# EasyEDA Pro project DAC8563.eprj

# Schematic Schematic1
Create Date: 2023-06-18; Page Name: P1; Project Name: DAC8563; Schematic Name: Schematic1; Update Date: 2023-07-07; Company: 嘉立创EDA; Page Size: A4; Version: V1.0
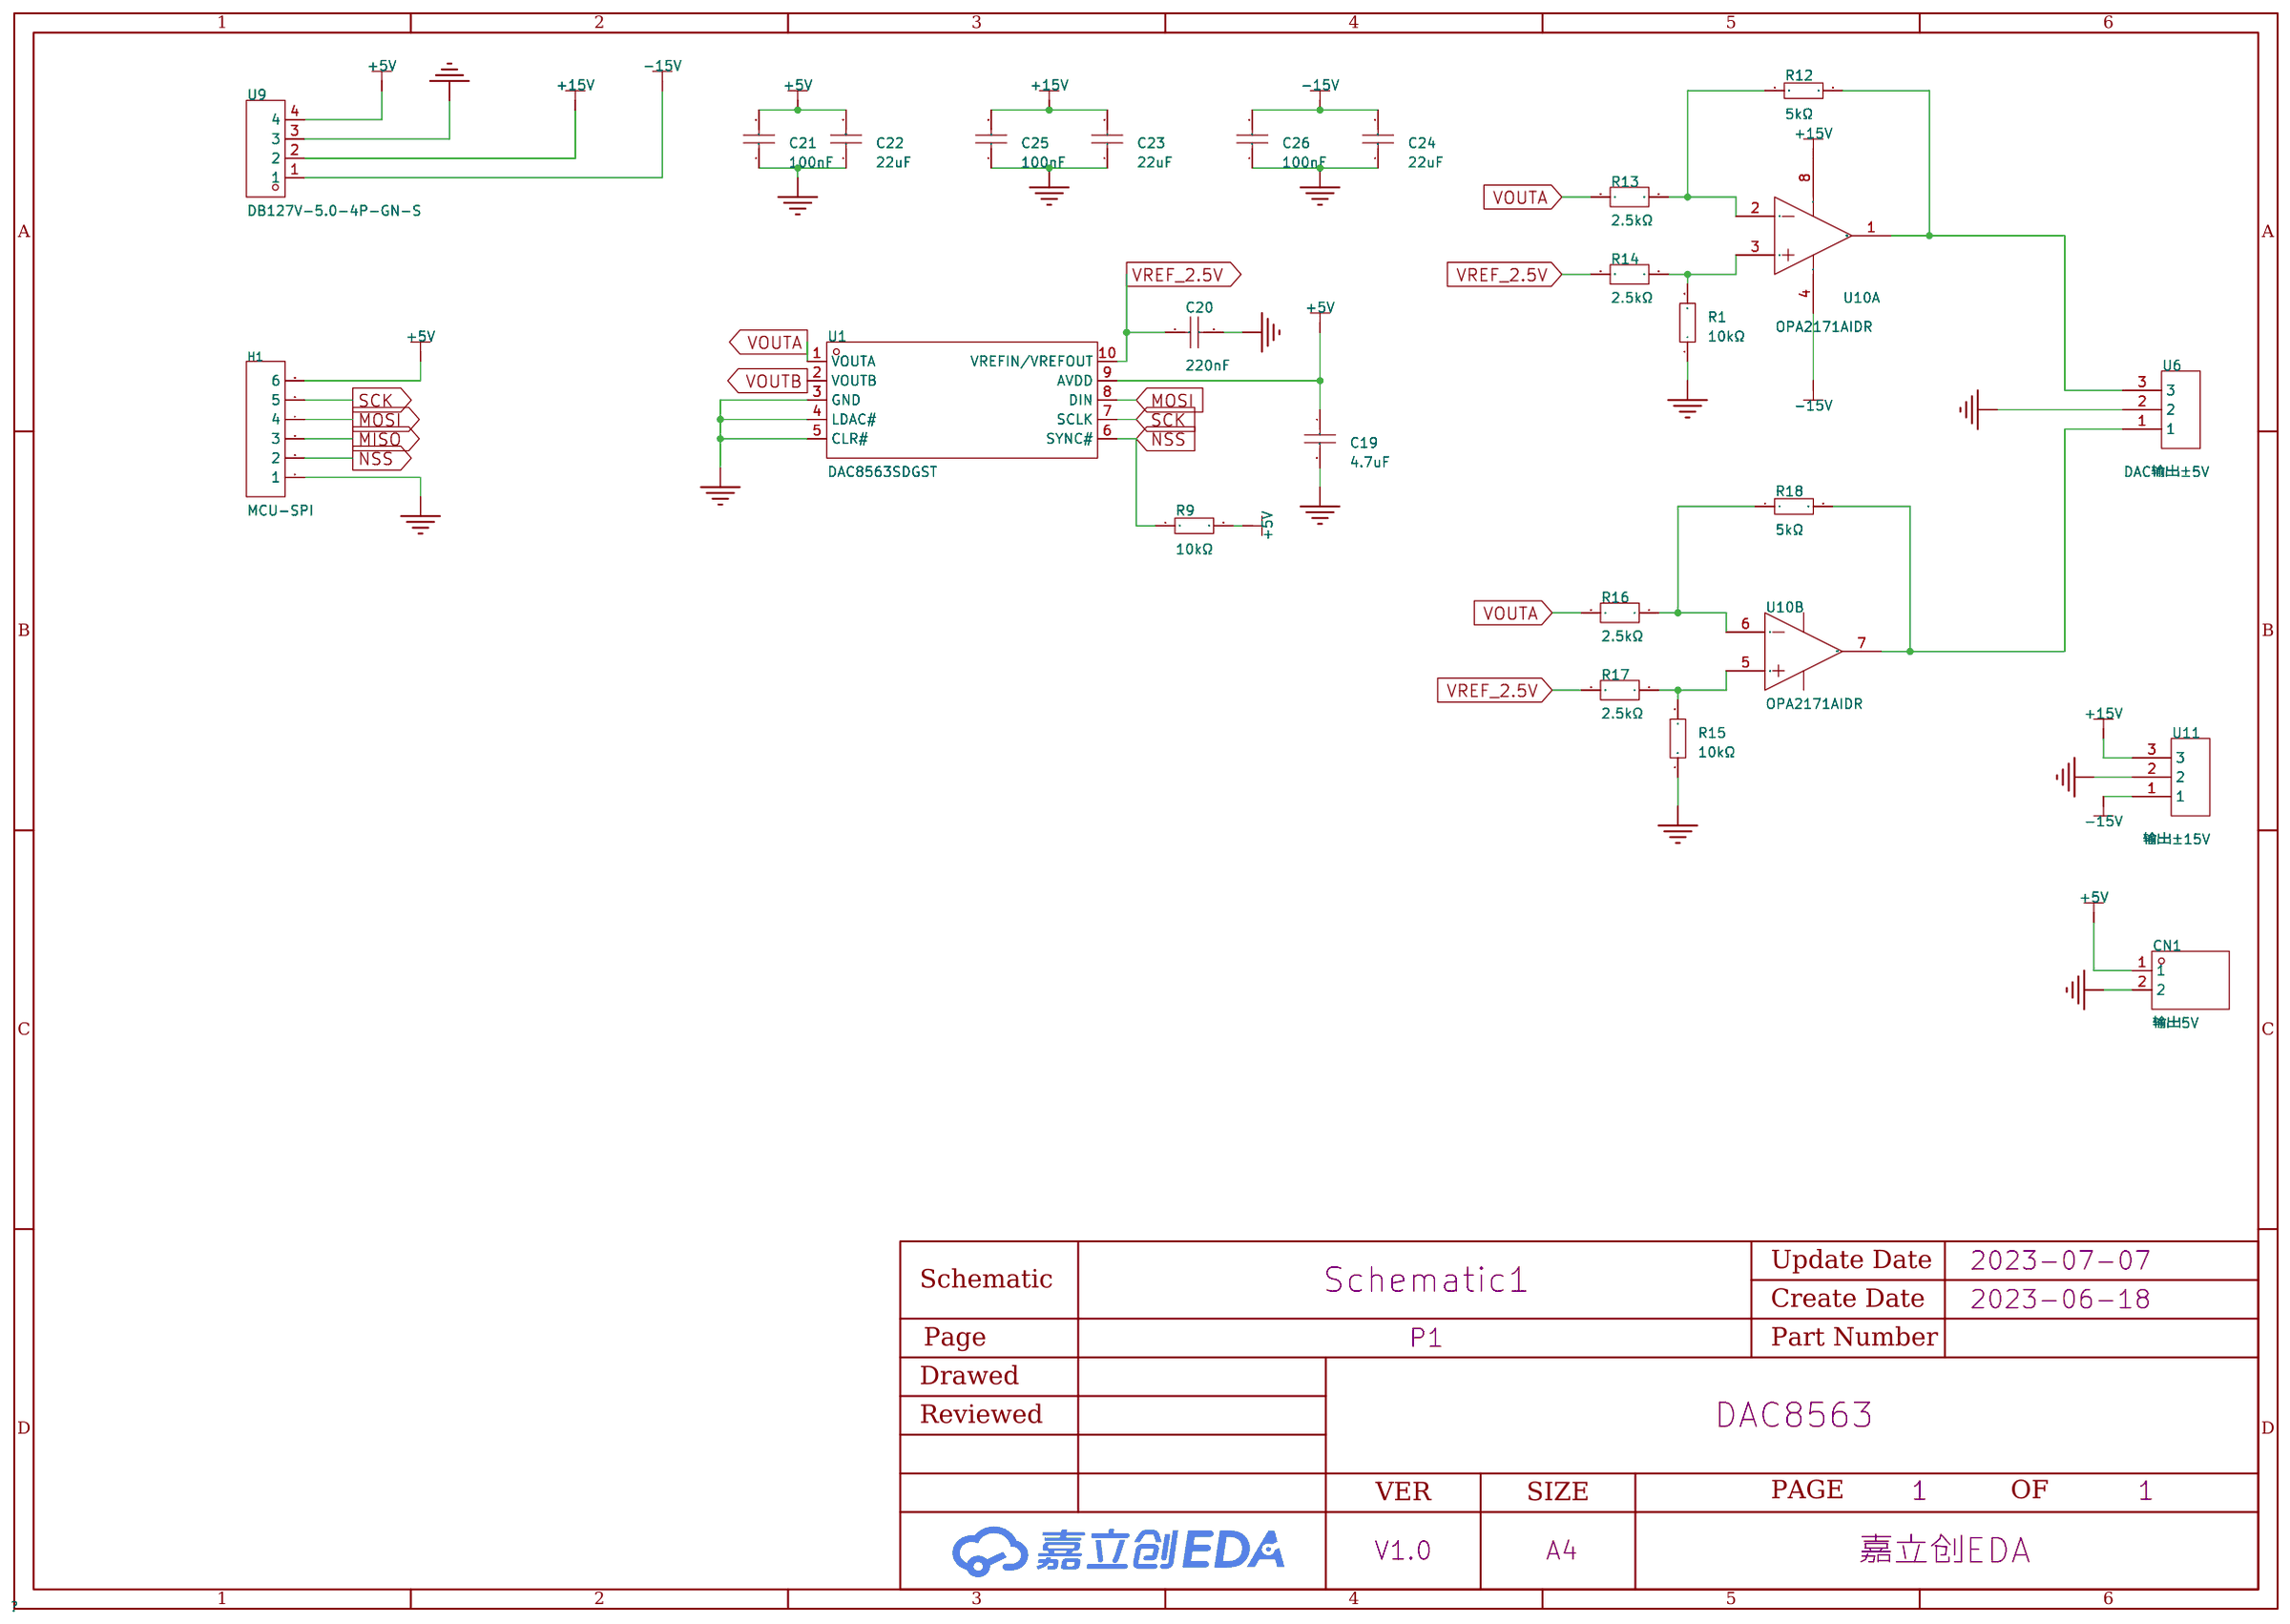
[diagram p0: schematic sheet]

## Parts
C19  4.7uF  [C0805]
C20  220nF  [C0805]
C21  100nF  [C0805]
C22  22uF  [C0805]
C23  22uF  [C0805]
C24  22uF  [C0805]
C25  100nF  [C0805]
C26  100nF  [C0805]
CN1  输出5V  [CONN-TH_B2B-XH-A-LF-SN]
H1  MCU-SPI  [HDR-TH_6P-P2.54-V-M-1]
R1  10kΩ  [R0805]
R9  10kΩ  [R0805]
R12  5kΩ  [R0805]
R13  2.5kΩ  [R0805]
R14  2.5kΩ  [R0805]
R15  10kΩ  [R0805]
R16  2.5kΩ  [R0805]
R17  2.5kΩ  [R0805]
R18  5kΩ  [R0805]
U1  DAC8563SDGST  [VSSOP-10_L3.0-W3.0-P0.50-LS4.9-BL]
U6  DAC输出±5V  [CONN-TH_3P-P2.50_A2501WV2-3P]
U9  DB127V-5.0-4P-GN-S  [CONN-TH_4P-P5.00_DB127V-5.0-4P-GN-S]
U10  OPA2171AIDR  [SOIC-8_L5.0-W4.0-P1.27-LS6.0-BL]  (sections 1,2)
U11  输出±15V  [CONN-TH_3P-P2.50_A2501WV2-3P]

## Library data of the parts
C19-C26 = 0805B104K500NT: 容值:100nF;精度:±10%;额定电压:50V;材质(温度系数):X7R;; LCSC Part Name: 100nF ±10% 50V; Supplier Part: C38141; Manufacturer: FH(风华); Supplier Footprint: 0805; JLCPCB Part Class: Extended Part; Datasheet: https://atta.szlcsc.com/upload/public/pdf/source/20170923/C38141_1506149447419988747.pdf; Supplier: LCSC; Tolerance: ±10%; Voltage Rated: 50V; Temperature Coefficient: X7R
CN1 = B2B-XH-A(LF)(SN): 参考系列:XH;间距:2.5mm;插针结构:1x2P;排数:1;每排PIN数:2;行距:-;安装方式:-;触头材质:黄铜;; LCSC Part Name: XH 2.5mm 1x2P; Supplier Part: C158012; Manufacturer: JST; Supplier Footprint: 插件,P=2.5mm; JLCPCB Part Class: Extended Part; Datasheet: https://atta.szlcsc.com/upload/public/pdf/source/20180319/9D0AC2122F92891443E3C996983D6D0E.pdf; Supplier: LCSC; Reference Series: XH; Pitch: 2.5mm; Pins Structure: 1x2P; Number of Rows: 1; Number of PINs Per Row: 2; Contact Material: 黄铜
H1 = 2.54-1x6P直针: 排数:单排;总PIN位数:6;间距:2.54mm;插针结构:1x6P;行距:-;安装类型:直插;圆针/方针:方针;额定电流:3A;额定电压:-;配合针长度:-;塑高:-;触头材质:黄铜;触头镀层:-;工作温度范围:-40℃~+105℃;颜色:黑色;; LCSC Part Name: 2.54mm 1x6P 直插 方针; Supplier Part: C37208; Manufacturer: BOOMELE(博穆精密); Supplier Footprint: 直插,P=2.54mm; JLCPCB Part Class: Extended Part; Supplier: LCSC; Number of Rows: 单排; Number of Pins: 6; Pitch: 2.54mm; Pin Structure: 1x6P; Mounting Type: 直插; Circluar Pins/Square Pins: 方针; Current Rating (Max): 3A; Contact Material: 黄铜; Operating Temperature Range: -40℃~+105℃; Color: 黑色
R1 R9 R12 R15 R18 = 0805W8F1002T5E_C17414: 电阻类型:厚膜电阻;阻值:10kΩ;精度:±1%;功率:125mW;; LCSC Part Name: 10kΩ ±1% 125mW; Supplier Part: C17414; Manufacturer: UNI-ROYAL(厚声); Manufacturer Part: 0805W8F1002T5E; Supplier Footprint: 0805; JLCPCB Part Class: Basic Part; Datasheet: https://atta.szlcsc.com/upload/public/pdf/source/20200306/C422600_1E6D84923E4A46A82E41ADD87F860B5C.pdf; Supplier: LCSC; Type: 厚膜电阻; Tolerance: ±1%; Power(Watts): 125mW; Temperature Coefficient: ±100ppm/℃; Overload Voltage (Max): 150V; Operating Temperature Range: -55℃~+155℃
R13 R14 R16 R17 = ARG05BTC2501N: 电阻类型:薄膜电阻;阻值:2.5kΩ;精度:±0.1%;功率:125mW;; LCSC Part Name: 2.5kΩ ±0.1% 125mW; Supplier Part: C2828736; Manufacturer: Viking(光颉); Supplier Footprint: 0805; JLCPCB Part Class: Extended Part; Datasheet: https://atta.szlcsc.com/upload/public/pdf/source/20211009/C2828736_56AC36CEB140B466557860EA8A132A37.pdf; Supplier: LCSC; Type: 薄膜电阻; Tolerance: ±0.1%; Power(Watts): 125mW; Temperature Coefficient: ±25ppm/℃; Overload Voltage (Max): 150V; Operating Temperature Range: -55℃~+155℃
U1 = DAC8563SDGST: Supplier Part: C2679492; Manufacturer: TI(德州仪器); Supplier Footprint: VSSOP-10-0.5mm; JLCPCB Part Class: Extended Part; Datasheet: https://atta.szlcsc.com/upload/public/pdf/source/20230221/ACD21AD43AD3151303AC8D1AE3FDF78F.pdf; Supplier: LCSC
U6 U11 = B3B-XH-A(LF)(SN): 参考系列:XH;间距:2.5mm;插针结构:1x3P;排数:1;每排PIN数:3;行距:-;安装方式:-;触头材质:黄铜;; LCSC Part Name: XH 2.5mm 1x3P; Supplier Part: C144394; Manufacturer: JST; Supplier Footprint: 插件,P=2.5mm; JLCPCB Part Class: Extended Part; Datasheet: https://atta.szlcsc.com/upload/public/pdf/source/20180327/C144394_40EBA2F68C817AED706C9EFF4B81600D.pdf; Supplier: LCSC; Reference Series: XH; Pitch: 2.5mm; Pins Structure: 1x3P; Number of Rows: 1; Number of PINs Per Row: 3; Contact Material: 黄铜
U9 = DB127V-5.0-4P-GN-S: 间距:5mm;排数:1;每排PIN数:4;安装方式:直针;额定电流:15A;额定电压:250V;线规 - AWG:14~26;线规 - mm?:1.5;工作温度范围:-40℃~+105℃;颜色:绿色;; LCSC Part Name: 5mm 排数:1 每排P数:4 直针; Supplier Part: C430624; Manufacturer: DIBO(地博电气); Supplier Footprint: 直插,P=5mm; JLCPCB Part Class: Extended Part; Datasheet: https://atta.szlcsc.com/upload/public/pdf/source/20211103/E26D74FF571F86D3B05732CA36761FFA.pdf; Supplier: LCSC; Pitch: 5mm; Number of Rows: 1; Number of PINs Per Row: 4; Mounting Style: 直针; Current Rating (Max): 15A; Voltage Rating (Max): 250V; Wire Gauge - AWG: 14~26; Wire Gauge - mm?: 1.5; Operating Temperature Range: -40℃~+105℃; Color: 绿色
U10 = OPA2171AIDR: 运放类型:General Purpose;放大器组数:2;增益带宽积（GBP）:3MHz;压摆率（SR）:1.5 V/us;电源电压:2.7V ~ 36V, ±1.35V ~ 18V;各通道供电电流:475uA;; Supplier Part: C40904; Manufacturer: TI(德州仪器); Supplier Footprint: SOIC-8; JLCPCB Part Class: Extended Part; Datasheet: https://atta.szlcsc.com/upload/public/pdf/source/20150124/1457707260506.pdf; Supplier: LCSC; Amplifier Type: General Purpose; Number of Circuits: 2; Gain Bandwidth Product（GBP）: 3MHz; Slew Rate（SR）: 1.5 V/us; Output Type: Rail-to-Rail; Supply Voltage（Single）: 2.7V ~ 36V, ±1.35V ~ 18V; Iq per channel (Typ): 475uA; Operating Temperature: -40°C ~ 125°C

## Nets
+5V: C19.1 C21.2 C22.2 CN1.1 H1.6 R9.2 U1.9(AVDD) U9.4
+15V: C23.2 C25.2 U9.2 U10.8(V+) U11.3
-15V: C24.2 C26.2 U9.1 U10.4(V-) U11.1
GND: C19.2 C20.2 C21.1 C22.1 C23.1 C24.1 C25.1 C26.1 CN1.2 H1.1 R1.1 R15.1 U1.3(GND) U1.4(LDAC#) U1.5(CLR#) U6.2 U9.3 U11.2
MISO: H1.3
MOSI: H1.4 U1.8(DIN)
NSS: H1.2 R9.1 U1.6(SYNC#)
SCK: H1.5 U1.7(SCLK)
VOUTA: R13.2 R16.2 U1.1(VOUTA)
VOUTB: U1.2(VOUTB)
VREF_2.5V: C20.1 R14.2 R17.2 U1.10(VREFIN/VREFOUT)
$1N6932: R1.2 R14.1 U10.3(IN A+)
$1N7066: R12.2 U6.3 U10.1(OUT A)
$1N8071: R12.1 R13.1 U10.2(IN A-)
$1N8400: R15.2 R17.1 U10.5(IN B+)
$1N8452: R16.1 R18.1 U10.6(IN B-)
$1N8456: R18.2 U6.1 U10.7(OUT B)

# Schematic Schematic2
Create Date: 2023-07-07; Page Name: P1; Project Name: DAC8563; Schematic Name: Schematic2; Update Date: 2023-07-07; Company: 嘉立创EDA; Page Size: A4; Version: V1.0
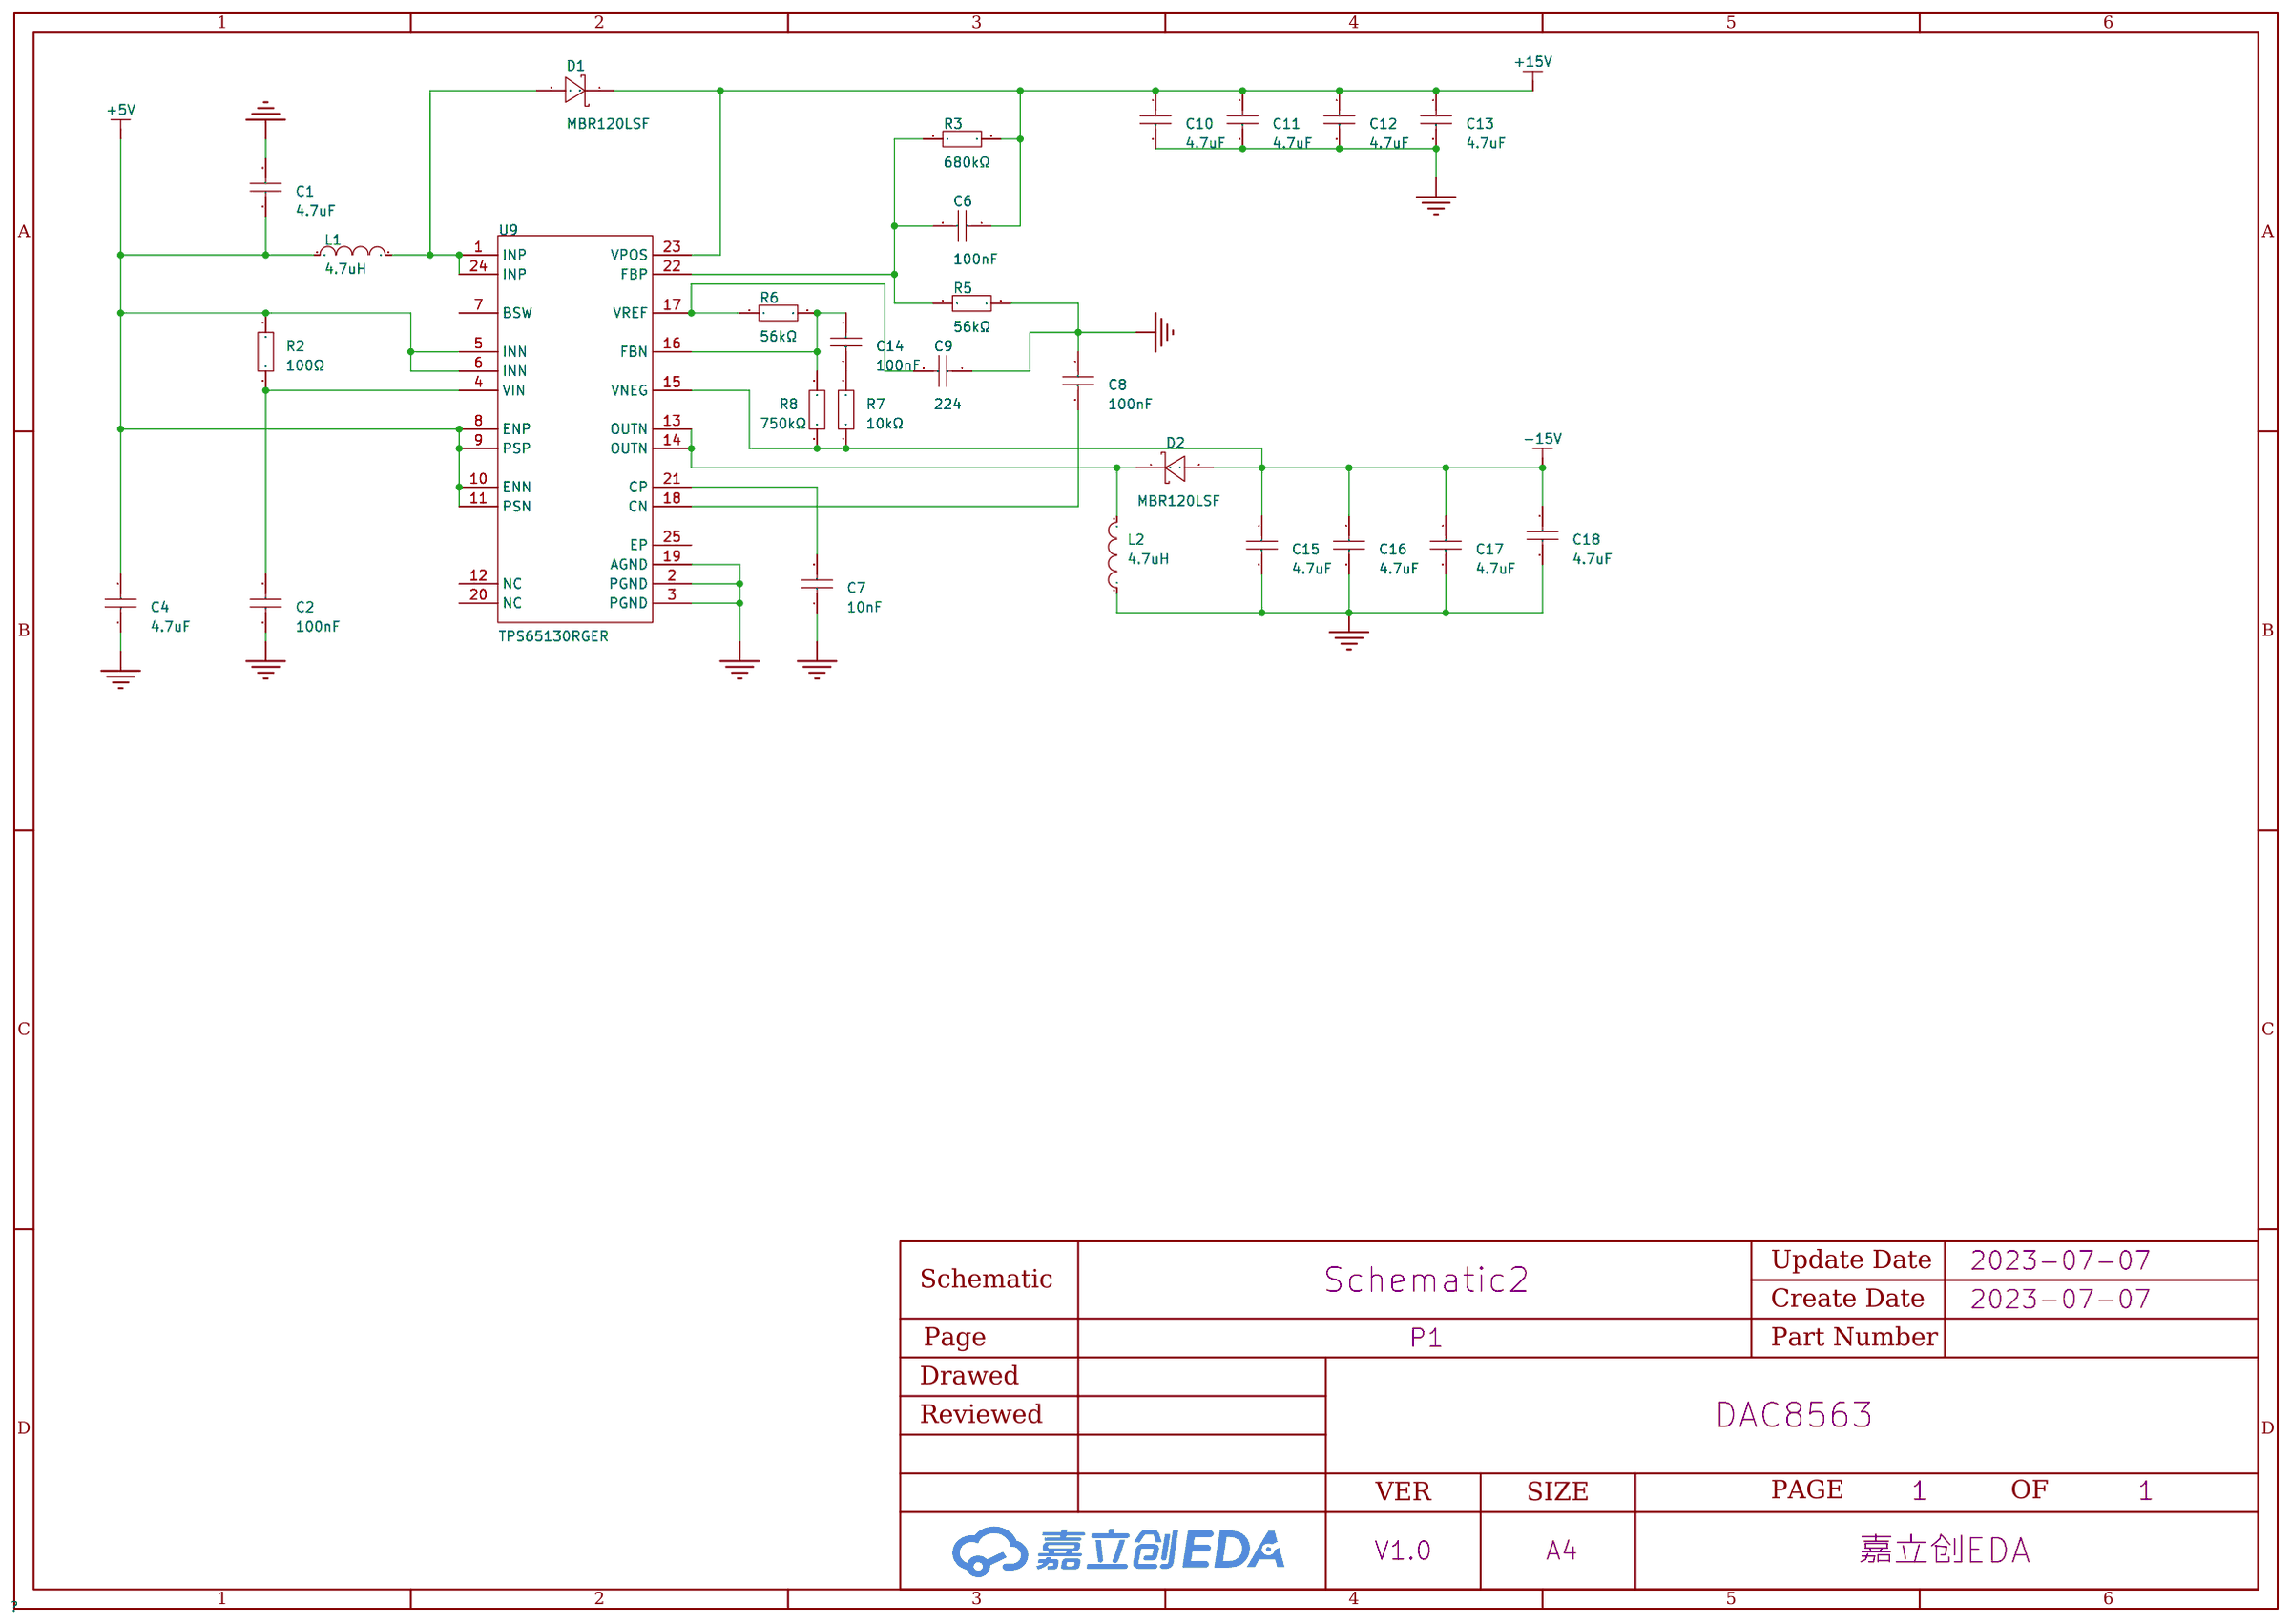
[diagram p1: schematic sheet]

## Parts
C1  4.7uF  [C0805]
C2  100nF  [C0805]
C4  4.7uF  [C0805]
C6  100nF  [C0805]
C7  10nF  [C0805]
C8  100nF  [C0805]
C9  224  [C0805]
C10  4.7uF  [C0805]
C11  4.7uF  [C0805]
C12  4.7uF  [C0805]
C13  4.7uF  [C0805]
C14  100nF  [C0805]
C15  4.7uF  [C0805]
C16  4.7uF  [C0805]
C17  4.7uF  [C0805]
C18  4.7uF  [C0805]
D1  MBR120LSF  [SOD-123_L2.8-W1.8-LS3.7-RD]
D2  MBR120LSF  [SOD-123_L2.8-W1.8-LS3.7-RD]
L1  4.7uH  [IND-SMD_L4.0-W4.0]
L2  4.7uH  [IND-SMD_L4.0-W4.0]
R2  100Ω  [R0805]
R3  680kΩ  [R0805]
R5  56kΩ  [R0805]
R6  56kΩ  [R0805]
R7  10kΩ  [R0805]
R8  750kΩ  [R0805]
U9  TPS65130RGER  [VQFN-24_L4.0-W4.0-P0.50-TL-EP]

## Library data of the parts
C1 C4 = CL21A475KAQNNNE: 容值:4.7uF;精度:±10%;额定电压:25V;材质(温度系数):X5R;; LCSC Part Name: 4.7uF ±10% 25V; Supplier Part: C1779; Manufacturer: SAMSUNG(三星); Supplier Footprint: 0805; JLCPCB Part Class: Basic Part; Datasheet: https://atta.szlcsc.com/upload/public/pdf/source/20160103/1457707696447.pdf; Supplier: LCSC; Tolerance: ±10%; Voltage Rated: 25V; Temperature Coefficient: X5R
C2 C6-C18 = 0805B104K500NT: 容值:100nF;精度:±10%;额定电压:50V;材质(温度系数):X7R;; LCSC Part Name: 100nF ±10% 50V; Supplier Part: C38141; Manufacturer: FH(风华); Supplier Footprint: 0805; JLCPCB Part Class: Extended Part; Datasheet: https://atta.szlcsc.com/upload/public/pdf/source/20170923/C38141_1506149447419988747.pdf; Supplier: LCSC; Tolerance: ±10%; Voltage Rated: 50V; Temperature Coefficient: X7R
D1 D2 = MBR120LSF: 直流反向耐压(Vr):20V;平均整流电流(Io):1A;正向压降(Vf):600mV@1A;; LCSC Part Name: 20V 1A 600mV@1A; Supplier Part: C130880; Manufacturer: SHIKUES(时科); Supplier Footprint: SOD-123; JLCPCB Part Class: Extended Part; Datasheet: https://atta.szlcsc.com/upload/public/pdf/source/20170918/C130880_1505703436167975387.pdf; Supplier: LCSC; Reverse Voltage (Vr): 20V; Average Rectified Current (Io): 1A; Forward Voltage (Vf@If): 600mV@1A
L1 L2 = SWPA4030S4R7MT: 直流电阻(DCR):78mΩ;精度:±20%;电感值:4.7uH;额定电流:2A;; LCSC Part Name: 4.7uH ±20%; Supplier Part: C57269; Manufacturer: Sunlord(顺络); Supplier Footprint: SMD; JLCPCB Part Class: Extended Part; Datasheet: https://atta.szlcsc.com/upload/public/pdf/source/20161024/1477287957557.pdf; Supplier: LCSC; DC Resistance (DCR): 78mΩ; Tolerance: ±20%; Height: 3mm; Width: 4mm; Rated Current: 2A; Length: 4mm
R2 = 0805W8F1000T5E: 电阻类型:厚膜电阻;阻值:100Ω;精度:±1%;功率:125mW;; LCSC Part Name: 100Ω ±1% 125mW; Supplier Part: C17408; Manufacturer: UNI-ROYAL(厚声); Supplier Footprint: 0805; JLCPCB Part Class: Basic Part; Datasheet: https://atta.szlcsc.com/upload/public/pdf/source/20200306/C422600_1E6D84923E4A46A82E41ADD87F860B5C.pdf; Supplier: LCSC; Type: 厚膜电阻; Tolerance: ±1%; Power(Watts): 125mW; Temperature Coefficient: ±100ppm/℃; Overload Voltage (Max): 150V; Operating Temperature Range: -55℃~+155℃
R3 R5-R8 = 0805W8F1002T5E_C17414: 电阻类型:厚膜电阻;阻值:10kΩ;精度:±1%;功率:125mW;; LCSC Part Name: 10kΩ ±1% 125mW; Supplier Part: C17414; Manufacturer: UNI-ROYAL(厚声); Manufacturer Part: 0805W8F1002T5E; Supplier Footprint: 0805; JLCPCB Part Class: Basic Part; Datasheet: https://atta.szlcsc.com/upload/public/pdf/source/20200306/C422600_1E6D84923E4A46A82E41ADD87F860B5C.pdf; Supplier: LCSC; Type: 厚膜电阻; Tolerance: ±1%; Power(Watts): 125mW; Temperature Coefficient: ±100ppm/℃; Overload Voltage (Max): 150V; Operating Temperature Range: -55℃~+155℃
U9 = TPS65130RGER: 功能类型:升压型；升降压型;同步整流:否;输出类型:可调;输出通道数:2;拓扑结构:升压式；降压式-升压式;输入电压:2.7V~5.5V;输出电压:±15V;输出电流(最大值):700mA;开关频率:1.38MHz;工作温度:-40℃~+85℃@(TA);; LCSC Part Name: 升降压型 升压型 Vin=2.7V~5.5V Vout=±15V 700mA; Supplier Part: C54989; Manufacturer: TI(德州仪器); Supplier Footprint: QFN-24(4x4); JLCPCB Part Class: Extended Part; Datasheet: https://atta.szlcsc.com/upload/public/pdf/source/20170925/C54989_1506321722096990529.pdf; Supplier: LCSC; Function: 升压型；升降压型; Synchronous Rectification: 否; Output Type: 可调; Number of Outputs: 2; Topology: 升压式；降压式-升压式; Input Voltage: 2.7V~5.5V; Output Voltage: ±15V; Output Current (Max): 700mA; Switching Frequency: 1.38MHz; Operating Temperature: -40℃~+85℃@(TA)

## Nets
+5V: C1.1 C4.2 L1.1 R2.2 U9.5(INN) U9.6(INN) U9.8(ENP) U9.9(PSP) U9.10(ENN) U9.11(PSN)
+15V: C6.1 C10.1 C11.1 C12.1 C13.1 D1.1(C) R3.2 U9.23(VPOS)
-15V: C15.1 C16.1 C17.1 C18.1 D2.2(A) R7.1 R8.2 U9.15(VNEG)
GND: C1.2 C2.1 C4.1 C7.1 C8.1 C9.1 C10.2 C11.2 C12.2 C13.2 C15.2 C16.2 C17.2 C18.2 L2.1 R5.2 U9.2(PGND) U9.3(PGND) U9.19(AGND)
Net-(C2-2): C2.2 R2.1 U9.4(VIN)
Net-(C6-2): C6.2 R3.1 R5.1 U9.22(FBP)
Net-(C7-2): C7.2 U9.21(CP)
Net-(C8-2): C8.2 U9.18(CN)
Net-(C9-2): C9.2 R6.1 U9.17(VREF)
Net-(C14-1): C14.1 R6.2 R8.1 U9.16(FBN)
Net-(C14-2): C14.2 R7.2
Net-(D1-2): D1.2(A) L1.2 U9.1(INP) U9.24(INP)
Net-(D2-1): D2.1(C) L2.2 U9.13(OUTN) U9.14(OUTN)

Not connected (* = marked no-connect by the designer): U9 7(BSW) 12(NC) 20(NC) 25(EP)

# Board PCB1
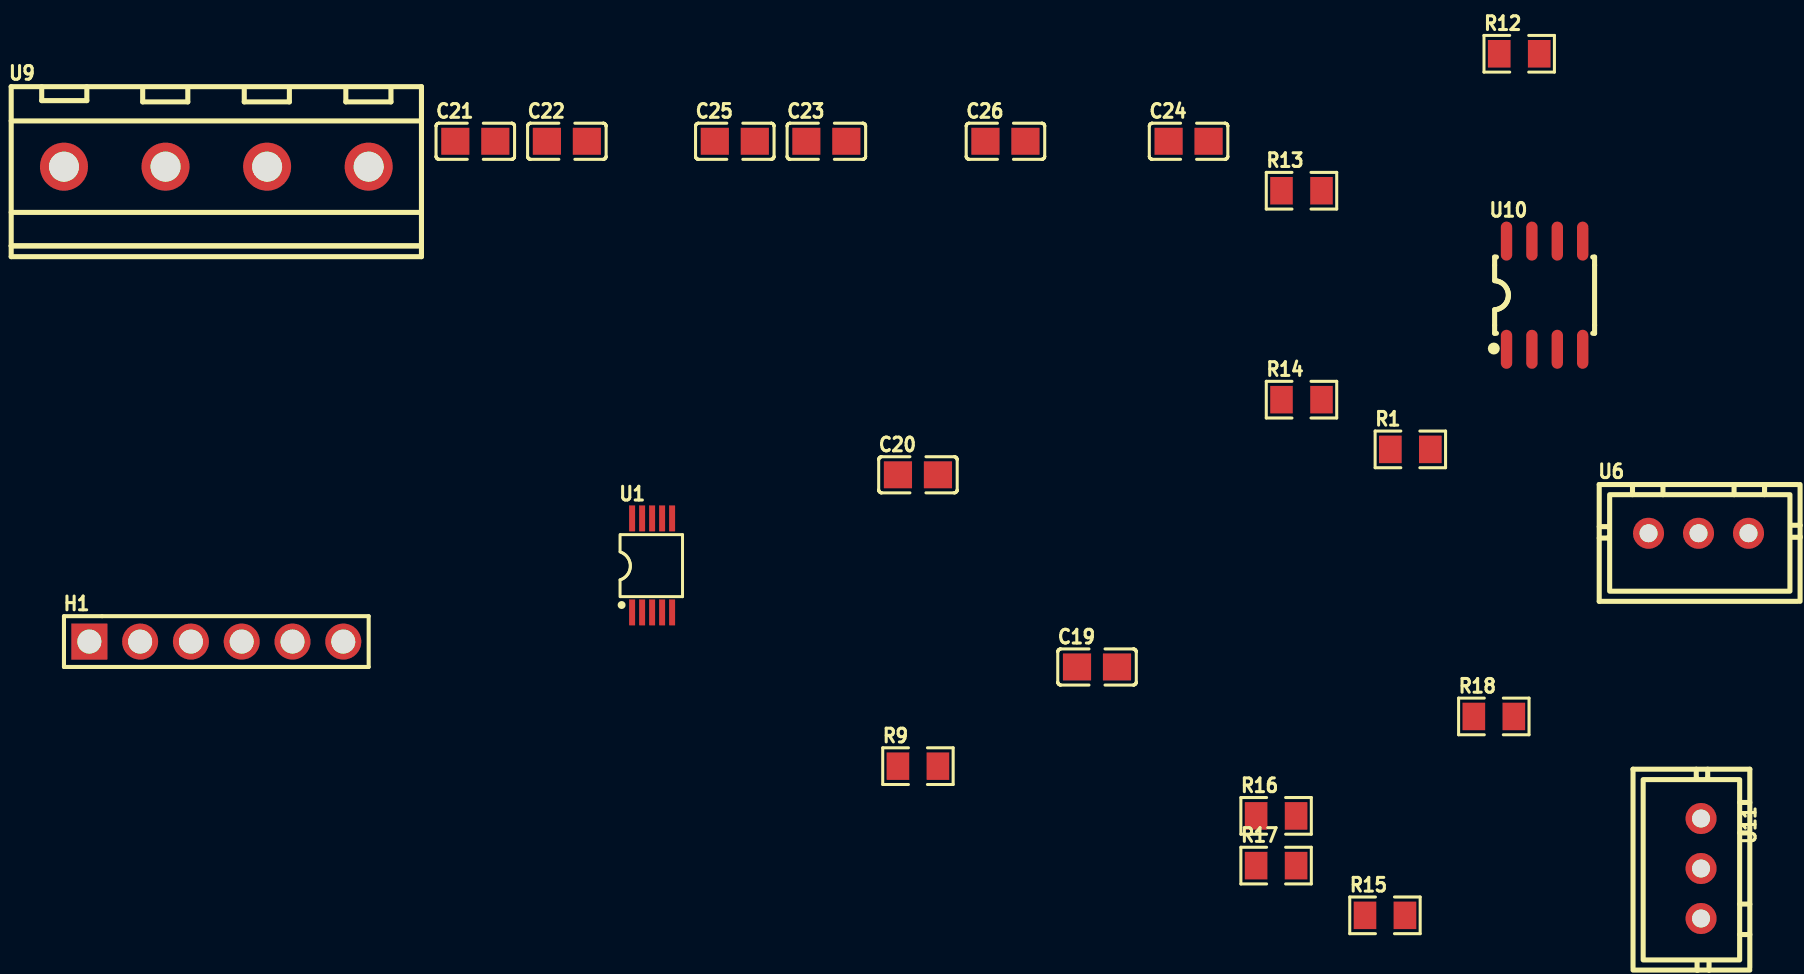
[diagram p2: board, top side]
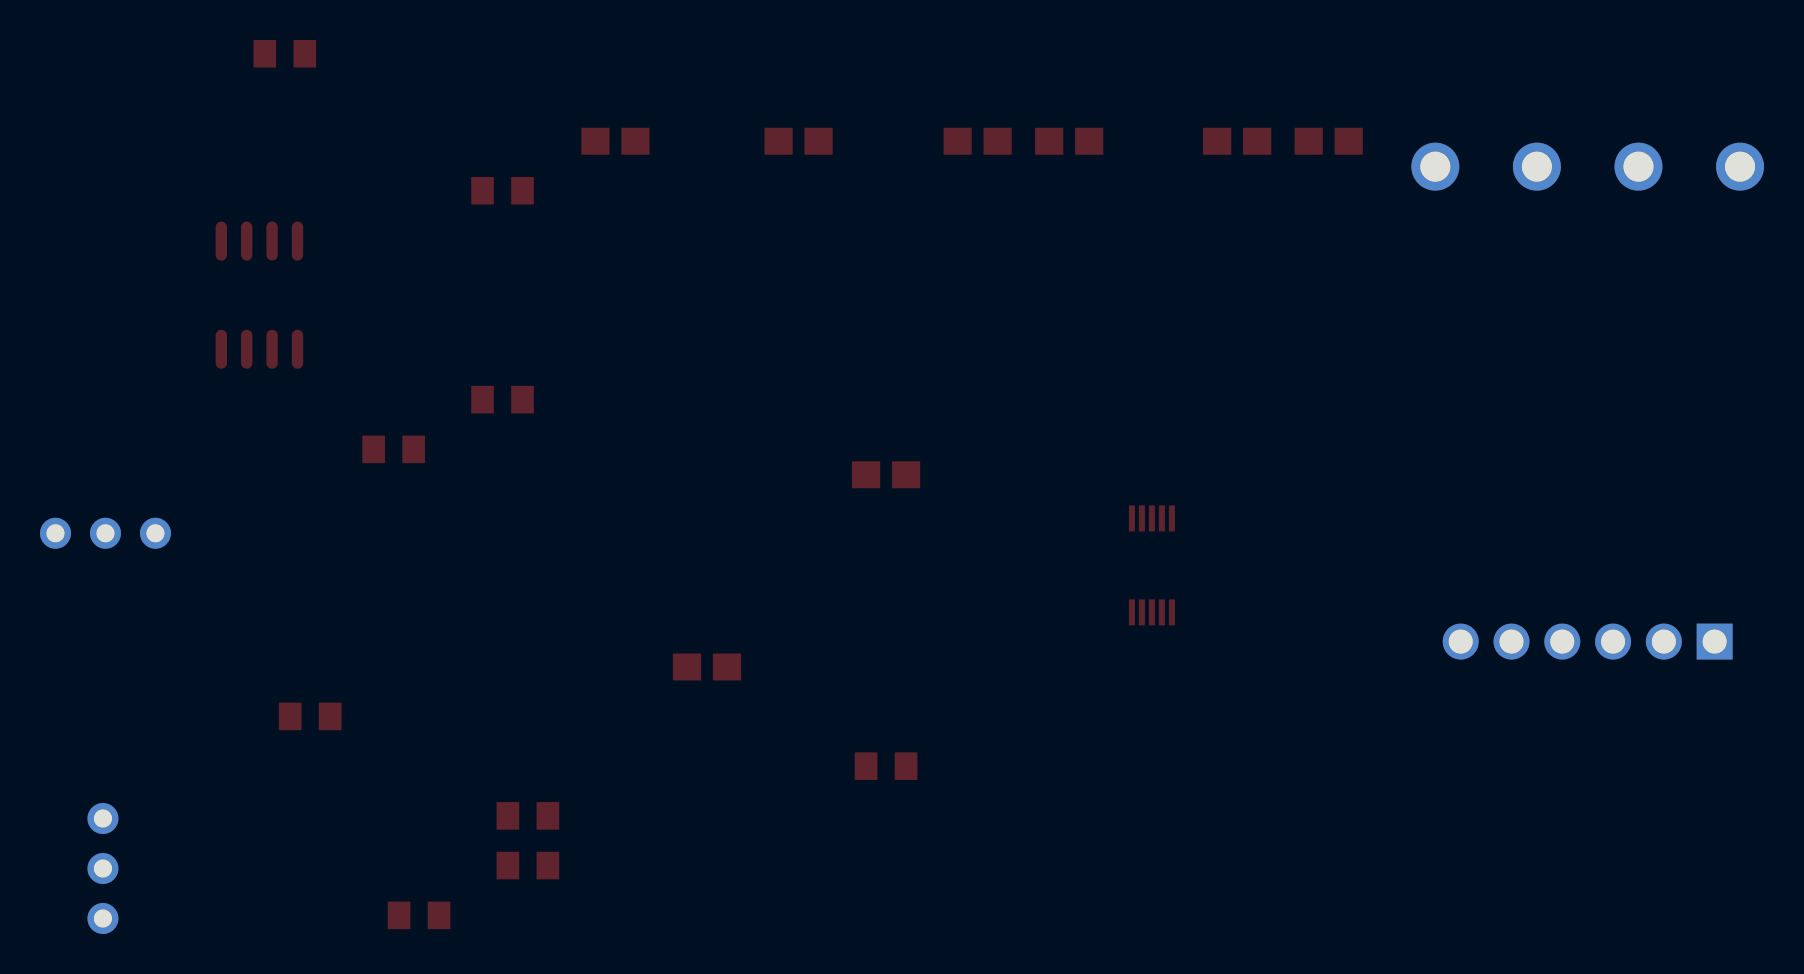
[diagram p3: board, bottom side, seen from below]

No outline. copper layers: Top Layer, Bottom Layer. Coordinates in mm from the lowest, leftmost part position.
Stack: Top Layer 0.035mm / Dielectric1 1.51mm FR4 er 4.5 / Bottom Layer 0.035mm

## Design rules (mm)
template: JLCPCB Capability(Two Layers Board)
spacing copperThickness1oz (default): track to track 0.102, other pairs 0.152 to 0.3
spacing copperThickness2oz: track to track 0.203, other pairs 0.152 to 0.3
track width copperThickness1oz (default): min 0.127, default 0.254, max 2.54
track width copperThickness2oz: min 0.203, default 0.254, max 2.54
differential pair differentialPair (default): width min 0.127, default 0.254, max 2.54; gap min 0.152, default 0.152
via viaSize (default): diameter min 0.5, default 0.61, max 10; hole min 0.3, default 0.305, max 6.3

## Placement (name value [footprint] x y rotation side)
C19  4.7uF  [C0805]  44.05 12.42 0 top
C20  220nF  [C0805]  35.09 22.03 0 top
C21  100nF  [C0805]  12.95 38.71 0 top
C22  22uF  [C0805]  17.53 38.71 0 top
C23  22uF  [C0805]  30.51 38.71 0 top
C24  22uF  [C0805]  48.63 38.71 0 top
C25  100nF  [C0805]  25.93 38.71 0 top
C26  100nF  [C0805]  39.47 38.71 0 top
H1  MCU-SPI  [HDR-TH_6P-P2.54-V-M-1]  0 13.69 0 top
R1  10kΩ  [R0805]  59.72 23.3 0 top
R9  10kΩ  [R0805]  35.09 7.46 0 top
R12  5kΩ  [R0805]  65.16 43.08 0 top
R13  2.5kΩ  [R0805]  54.28 36.24 0 top
R14  2.5kΩ  [R0805]  54.28 25.79 0 top
R15  10kΩ  [R0805]  58.45 0 0 top
R16  2.5kΩ  [R0805]  53 4.97 0 top
R17  2.5kΩ  [R0805]  53 2.49 0 top
R18  5kΩ  [R0805]  63.89 9.95 0 top
U1  DAC8563SDGST  [VSSOP-10_L3.0-W3.0-P0.50-LS4.9-BL]  21.8 17.5 0 top
U6  DAC输出±5V  [CONN-TH_3P-P2.50_A2501WV2-3P]  74.13 19.11 0 top
U9  DB127V-5.0-4P-GN-S  [CONN-TH_4P-P5.00_DB127V-5.0-4P-GN-S]  0 37.44 0 top
U10  OPA2171AIDR  [SOIC-8_L5.0-W4.0-P1.27-LS6.0-BL]  66.43 31.01 0 top
U11  输出±15V  [CONN-TH_3P-P2.50_A2501WV2-3P]  74.26 2.34 270 top

## Footprints (pads in the part's own frame, mm; a bottom-side part is the same pattern mirrored in y, then rotated)
C0805
  rect 1.41x1.35 smd: 1(-1,0) 2(1,0)
CONN-TH_3P-P2.50_A2501WV2-3P
  round 1.55 hole 0.9: 1(-2.5,0) 2(0,0) 3(2.5,0)
CONN-TH_4P-P5.00_DB127V-5.0-4P-GN-S
  round 2.4 hole 1.5: 1(-7.62,0) 2(-2.54,0) 3(2.54,0) 4(7.62,0)
HDR-TH_6P-P2.54-V-M-1
  rect 1.8x1.8 hole 1.2: 1(-6.35,0)
  round 1.8 hole 1.2: 2(-3.81,0) 3(-1.27,0) 4(1.27,0) 5(3.81,0) 6(6.35,0)
R0805
  rect 1.133x1.377 smd: 1(-1,0) 2(1,0)
SOIC-8_L5.0-W4.0-P1.27-LS6.0-BL
  oval 0.569x1.95 smd: 1(-1.905,-2.705) 2(-0.635,-2.705) 3(0.635,-2.705) 4(1.905,-2.705) 5(1.905,2.705) 6(0.635,2.705) 7(-0.635,2.705) 8(-1.905,2.705)
VSSOP-10_L3.0-W3.0-P0.50-LS4.9-BL
  rect 0.3x1.3 smd: 1(-1,-2.35) 2(-0.5,-2.35) 3(0,-2.35) 4(0.5,-2.35) 5(1,-2.35) 6(1,2.35) 7(0.5,2.35) 8(0,2.35) 9(-0.5,2.35) 10(-1,2.35)

## Nets
As in the schematic.
